# Altium schematic sheet TAS5711.SchDoc
size A3; PageSetup: Record=PageOptions|CenterHorizontal=True|CenterVertical=True|PrintScale=0.68|XCorrection=1.00|YCorrection=1.00|PrintKind=1|BorderSize=5000000|LeftOffset=0|BottomOffset=0|Orientation=2|PaperLength=1000|PaperWidth=1000|Scale=100|PaperSource=7|PrintQuality=-4|MediaType=1|DitherType=10|PrintScaleMode=1|PaperKind=A3
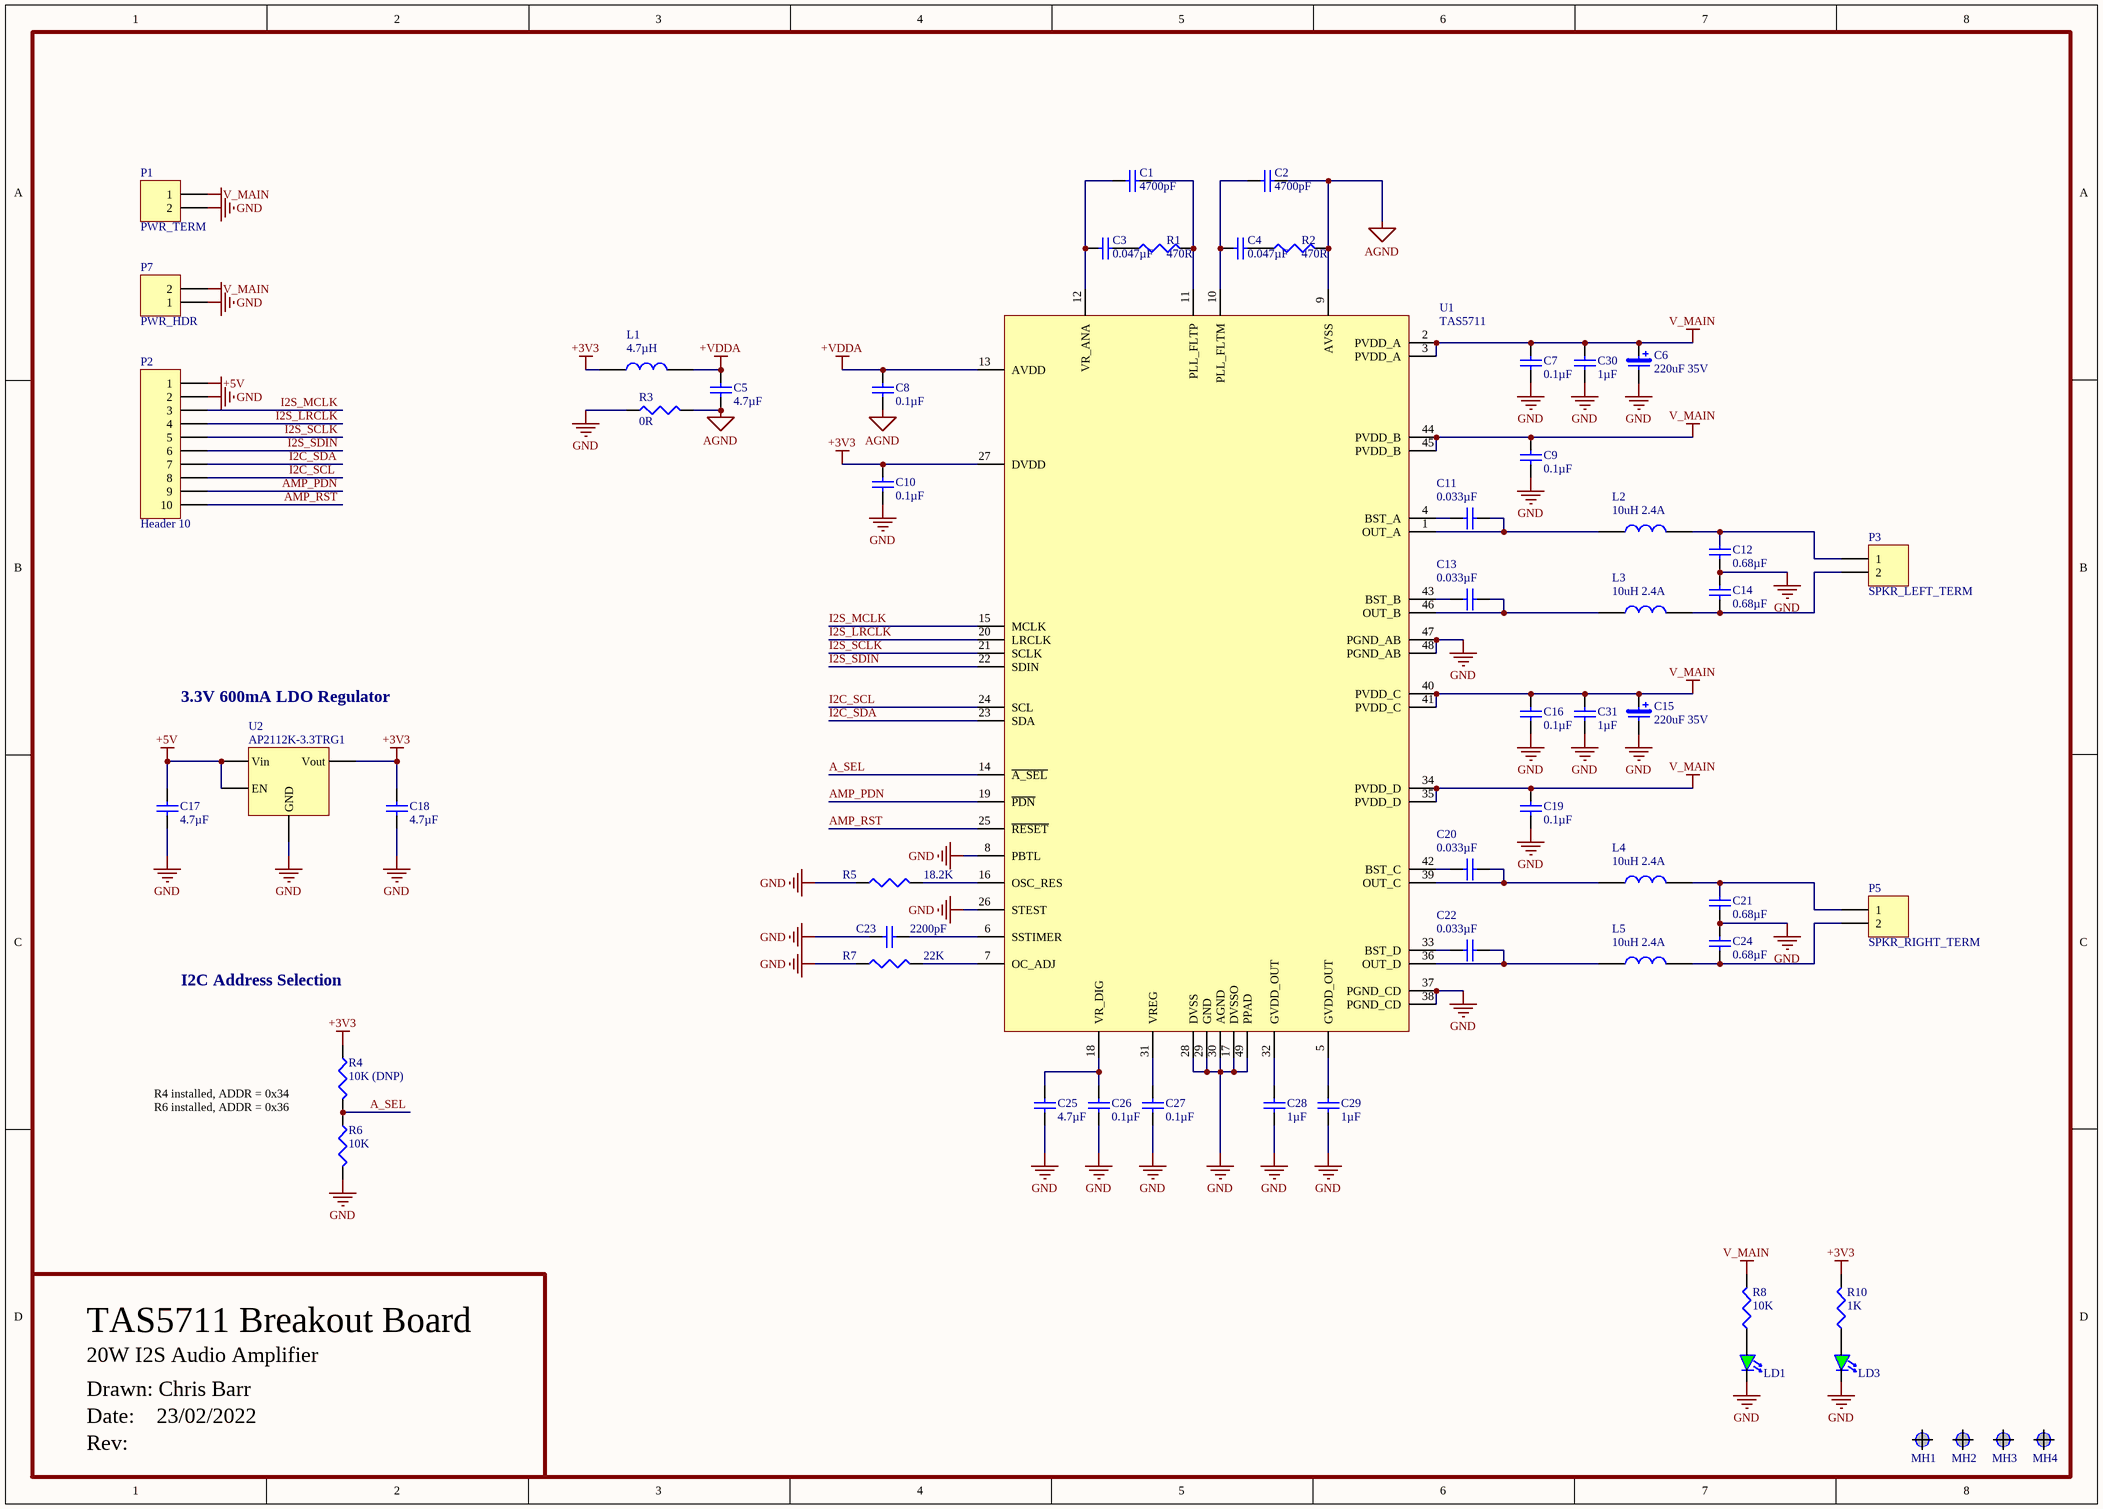
[diagram p0: TAS5711.SchDoc]

## Parts
C1  value 4700pF  [CAPC1608X90N]  (hidden comment: Capacitor)
C2  value 4700pF  [CAPC1608X90N]  (hidden comment: Capacitor)
C3  value 0.047µF  [CAPC1608X90N]  (hidden comment: Capacitor)
C4  value 0.047µF  [CAPC1608X90N]  (hidden comment: Capacitor)
C5  value 4.7µF  [CAPC1608X90N]  (hidden comment: Capacitor)
C6  value 220uF 35V  [CAPAE250P680X1220_VERT]  (hidden comment: CapE-8.0-THT-220uF-35V)
C7  value 0.1µF  [CAPC1608X90N]  (hidden comment: Capacitor)
C8  value 0.1µF  [CAPC1608X90N]  (hidden comment: Capacitor)
C9  value 0.1µF  [CAPC1608X90N]  (hidden comment: Capacitor)
C10  value 0.1µF  [CAPC1608X90N]  (hidden comment: Capacitor)
C11  value 0.033µF  [CAPC1608X90N]  (hidden comment: Capacitor)
C12  value 0.68µF  [CAPC3216X100N]  (hidden comment: Capacitor)
C13  value 0.033µF  [CAPC1608X90N]  (hidden comment: Capacitor)
C14  value 0.68µF  [CAPC3216X100N]  (hidden comment: Capacitor)
C15  value 220uF 35V  [CAPAE250P680X1220_VERT]  (hidden comment: CapE-8.0-THT-220uF-35V)
C16  value 0.1µF  [CAPC1608X90N]  (hidden comment: Capacitor)
C17  value 4.7µF  [CAPC1608X90N]  (hidden comment: Capacitor)
C18  value 4.7µF  [CAPC1608X90N]  (hidden comment: Capacitor)
C19  value 0.1µF  [CAPC1608X90N]  (hidden comment: Capacitor)
C20  value 0.033µF  [CAPC1608X90N]  (hidden comment: Capacitor)
C21  value 0.68µF  [CAPC3216X100N]  (hidden comment: Capacitor)
C22  value 0.033µF  [CAPC1608X90N]  (hidden comment: Capacitor)
C23  value 2200pF  [CAPC1608X90N]  (hidden comment: Capacitor)
C24  value 0.68µF  [CAPC3216X100N]  (hidden comment: Capacitor)
C25  value 4.7µF  [CAPC1608X90N]  (hidden comment: Capacitor)
C26  value 0.1µF  [CAPC1608X90N]  (hidden comment: Capacitor)
C27  value 0.1µF  [CAPC1608X90N]  (hidden comment: Capacitor)
C28  value 1µF  [CAPC1608X90N]  (hidden comment: Capacitor)
C29  value 1µF  [CAPC1608X90N]  (hidden comment: Capacitor)
C30  value 1µF  [CAPC1608X90N]  (hidden comment: Capacitor)
C31  value 1µF  [CAPC1608X90N]  (hidden comment: Capacitor)
L1  value 4.7µH  [Res 2012-0805]
L2  value 10uH 2.4A  [SRN6045TA SMD Inductor]  (hidden comment: Inductor SMD 10uH 2.4A)
L3  value 10uH 2.4A  [SRN6045TA SMD Inductor]  (hidden comment: Inductor SMD 10uH 2.4A)
L4  value 10uH 2.4A  [SRN6045TA SMD Inductor]  (hidden comment: Inductor SMD 10uH 2.4A)
L5  value 10uH 2.4A  [SRN6045TA SMD Inductor]  (hidden comment: Inductor SMD 10uH 2.4A)
LD1  LEDG  0603  [LED 1608-0603]  (value not drawn)
LD3  LEDG  0603  [LED 1608-0603]  (value not drawn)
MH1  Screw Hole  [M3-Hole-2]  (value not drawn)  (no BOM)
MH2  Screw Hole  [M3-Hole-2]  (value not drawn)  (no BOM)
MH3  Screw Hole  [M3-Hole-2]  (value not drawn)  (no BOM)
MH4  Screw Hole  [M3-Hole-2]  (value not drawn)  (no BOM)
P1  PWR_TERM  [TERM2 3.5mm]
P2  Header 10  [HDR1X10]
P3  SPKR_LEFT_TERM  [TERM2 3.5mm]
P5  SPKR_RIGHT_TERM  [TERM2 3.5mm]
P7  PWR_HDR  [HDR1X2-HEADER]
R1  value 470R  [RES 1608-0603]  (hidden comment: Resistor)
R2  value 470R  [RES 1608-0603]  (hidden comment: Resistor)
R3  value 0R  [RES 1608-0603]  (hidden comment: Res-0603-0R)
R4  value 10K (DNP)  [RES 1608-0603]  (hidden comment: Resistor)  (no BOM)
R5  value 18.2K  [RES 1608-0603]  (hidden comment: Resistor)
R6  value 10K  [RES 1608-0603]  (hidden comment: Resistor)
R7  value 22K  [RES 1608-0603]  (hidden comment: Resistor)
R8  value 10K  [RES 1608-0603]  (hidden comment: Resistor)
R10  value 1K  [RES 1608-0603]  (hidden comment: Resistor)
U1  TAS5711  [TSQFP50P900X900X105_HS-49M]
U2  AP2112K-3.3TRG1  [SOT23-5]

## Nets
+3V3: C10.2 C18.2 L1.1 R4.1 R10.2 U1.27(DVDD) U2.5(Vout)
+5V: C17.2 P2.1 U2.1(Vin) U2.3(EN)
+VDDA: C5.2 C8.2 L1.2 U1.13(AVDD)
AGND: C2.2 C5.1 C8.1 R2.2 R3.2 U1.9(AVSS)
GND: C6.2 C7.1 C9.1 C10.1 C12.1 C14.2 C15.2 C16.1 C17.1 C18.1 C19.1 C21.1 C23.1 C24.2 C25.1 C26.1 C27.1 C28.1 C29.1 C30.1 C31.1 LD1.2(K) LD3.2(K) P1.2 P2.2 P7.1 R3.1 R5.1 R6.2 R7.1 U1.8(PBTL) U1.17(DVSSO) U1.26(STEST) U1.28(DVSS) U1.29(GND) U1.30(AGND) U1.37(PGND_CD) U1.38(PGND_CD) U1.47(PGND_AB) U1.48(PGND_AB) U1.49(PPAD) U2.2(GND)
V_MAIN: C6.1 C7.2 C9.2 C15.1 C16.2 C19.2 C30.2 C31.2 P1.1 P7.2 R8.2 U1.2(PVDD_A) U1.3(PVDD_A) U1.34(PVDD_D) U1.35(PVDD_D) U1.40(PVDD_C) U1.41(PVDD_C) U1.44(PVDD_B) U1.45(PVDD_B)
A_SEL: R4.2 R6.1 U1.14(~{A_SEL})
AMP_PDN: P2.9 U1.19(~{PDN})
AMP_RST: P2.10 U1.25(~{RESET})
I2C_SCL: P2.8 U1.24(SCL)
I2C_SDA: P2.7 U1.23(SDA)
I2S_LRCLK: P2.4 U1.20(LRCLK)
I2S_MCLK: P2.3 U1.15(MCLK)
I2S_SCLK: P2.5 U1.21(SCLK)
I2S_SDIN: P2.6 U1.22(SDIN)
NetC1_1: C1.1 C3.1 U1.12(VR_ANA)
NetC1_2: C1.2 R1.2 U1.11(PLL_FLTP)
NetC2_1: C2.1 C4.1 U1.10(PLL_FLTM)
NetC3_2: C3.2 R1.1
NetC4_2: C4.2 R2.1
NetC11_1: C11.1 U1.4(BST_A)
NetC11_2: C11.2 L2.1 U1.1(OUT_A)
NetC12_2: C12.2 L2.2 P3.1
NetC13_1: C13.1 U1.43(BST_B)
NetC13_2: C13.2 L3.1 U1.46(OUT_B)
NetC14_1: C14.1 L3.2 P3.2
NetC20_1: C20.1 U1.42(BST_C)
NetC20_2: C20.2 L4.1 U1.39(OUT_C)
NetC21_2: C21.2 L4.2 P5.1
NetC22_1: C22.1 U1.33(BST_D)
NetC22_2: C22.2 L5.1 U1.36(OUT_D)
NetC23_2: C23.2 U1.6(SSTIMER)
NetC24_1: C24.1 L5.2 P5.2
NetC25_2: C25.2 C26.2 U1.18(VR_DIG)
NetC27_2: C27.2 U1.31(VREG)
NetC28_2: C28.2 U1.32(GVDD_OUT)
NetC29_2: C29.2 U1.5(GVDD_OUT)
NetLD1_1: LD1.1(A) R8.1
NetLD3_1: LD3.1(A) R10.1
NetR5_2: R5.2 U1.16(OSC_RES)
NetR7_2: R7.2 U1.7(OC_ADJ)

Not connected (* = marked no-connect by the designer): MH1 M3(0); MH2 M3(0); MH3 M3(0); MH4 M3(0)

## Notes on the sheet
- 3.3V 600mA LDO Regulator
- I2C Address Selection
- R4 installed, ADDR = 0x34
  R6 installed, ADDR = 0x36
- TAS5711 Breakout Board
- Drawn: Chris Barr
- 20W I2S Audio Amplifier
- Date:    23/02/2022
- Rev:
- Title
- Size:
- Date:
- File:
- A1
- Number:
- Time:
- Revision:
- Sheet
- of

## Library data of the parts
C1 C2 = UMJ107BB7472KAHT: CAP CER 4700PF 50V X7R 0603; Manufacturer 1: Taiyo Yuden; Note: Approved sub OK; Tolerance: ±10%; Type: X5R; Revision: July-2002: Re-released for DXP Platform.; Voltage: 50V; Supplier 1: Digi-Key; Supplier Part Number 1: 587-4470-1-ND; Package: 0402; Manufacturer Part Number 1: UMJ107BB7472KAHT; Temperature Coefficient: X7R; Operating Temperature: -55°C ~ 125°C; Package / Case: 0603 (1608 Metric); Size / Dimension: 0.063" L x 0.031" W (1.60mm x 0.80mm); Thickness (Max): 0.039" (1.00mm)
C3 C4 = TMK107BJ473KAHT: CAP CER 0.047UF 25V X5R 0603; Manufacturer 1: Taiyo Yuden; Note: Approved sub OK; Tolerance: ±10%; Revision: July-2002: Re-released for DXP Platform.; Voltage: 25V; Supplier 1: Digi-Key; Supplier Part Number 1: 587-3475-1-ND; Package: 0402; Type: X5R; Manufacturer Part Number 1: TMK107BJ473KAHT; Temperature Coefficient: X5R; Operating Temperature: -55°C ~ 85°C; Package / Case: 0603 (1608 Metric); Size / Dimension: 0.063" L x 0.031" W (1.60mm x 0.80mm); Thickness (Max): 0.035" (0.90mm)
C5 C17 C18 C25 = C1608X5R1C475K080AC: CAP CER 4.7UF 16V X5R 0603; Manufacturer 1: TDK Corporation; Note: Approved sub OK; Tolerance: ±10%; Revision: July-2002: Re-released for DXP Platform.; Voltage: 16V; Supplier 1: Digi-Key; Supplier Part Number 1: 445-7478-1-ND; Package: 0402; Type: X5R; Manufacturer Part Number 1: C1608X5R1C475K080AC; Temperature Coefficient: X5R; Operating Temperature: -55°C ~ 85°C; Package / Case: 0603 (1608 Metric); Size / Dimension: 0.063" L x 0.031" W (1.60mm x 0.80mm); Thickness (Max): 0.035" (0.90mm)
C6 C15 = CapE-8.0-THT-220uF-35V: CAP ALUM 220UF 20% 35V RADIAL; Note: Approved sub OK; Published: 8-Jun-2000; Revision: July-2002: Re-released for DXP Platform.; Publisher: Altium Limited; Supplier 1: Digi-Key; Supplier Part Number 1: 732-8946-1-ND
C7-C10 C16 C19 C26 C27 = UMJ107BB7104KAHT: CAP CER 0.1UF 50V X7R 0603; Manufacturer 1: Taiyo Yuden; Note: Approved sub OK; Tolerance: ±10%; Type: X5R; Revision: July-2002: Re-released for DXP Platform.; Voltage: 50V; Supplier 1: Digi-Key; Supplier Part Number 1: 587-4474-1-ND; Package: 0402; Manufacturer Part Number 1: UMJ107BB7104KAHT; Temperature Coefficient: X7R; Operating Temperature: -55°C ~ 125°C; Package / Case: 0603 (1608 Metric); Size / Dimension: 0.063" L x 0.031" W (1.60mm x 0.80mm); Thickness (Max): 0.039" (1.00mm)
C11 C13 C20 C22 = UMJ107BB7104KAHT: CAP CER 0.033UF 50V X7R 0603; Manufacturer 1: Taiyo Yuden; Note: Approved sub OK; Tolerance: ±10%; Revision: July-2002: Re-released for DXP Platform.; Voltage: 50V; Supplier 1: Digi-Key; Supplier Part Number 1: 399-14292-1-ND; Package: 0402; Type: X7R; Manufacturer Part Number 1: UMJ107BB7104KAHT; Temperature Coefficient: X7R; Operating Temperature: -55°C ~ 125°C; Package / Case: 0603 (1608 Metric); Size / Dimension: 0.063" L x 0.031" W (1.60mm x 0.80mm); Thickness (Max): 0.039" (1.00mm)
C12 C14 C21 C24 = C3216X7R2A684K160AA: CAP CER 0.68UF 100V X7R 1206; Manufacturer 1: TDK Corporation; Note: Approved sub OK; Tolerance: ±10%; Type: X5R; Revision: July-2002: Re-released for DXP Platform.; Voltage: 100V; Supplier 1: Digi-Key; Supplier Part Number 1: 445-14810-1-ND; Package: 0402; Manufacturer Part Number 1: C3216X7R2A684K160AA; Temperature Coefficient: X7R; Operating Temperature: -55°C ~ 125°C; Package / Case: 1206 (3216 Metric); Size / Dimension: 0.126" L x 0.063" W (3.20mm x 1.60mm); Thickness (Max): 0.071" (1.80mm)
C23 = C1608X5R2A222M080AA: CAP CER 2200PF 100V X5R 0603; Manufacturer 1: TDK Corporation; Note: Approved sub OK; Tolerance: ±20%; Revision: July-2002: Re-released for DXP Platform.; Voltage: 100V; Supplier 1: Digi-Key; Supplier Part Number 1: 445-14182-1-ND; Package: 0402; Type: X5R; Manufacturer Part Number 1: C1608X5R2A222M080AA; Temperature Coefficient: X5R; Operating Temperature: -55°C ~ 85°C; Package / Case: 0603 (1608 Metric); Size / Dimension: 0.063" L x 0.031" W (1.60mm x 0.80mm); Thickness (Max): 0.035" (0.90mm)
C28-C31 = GMK107BJ105KAHT: CAP CER 1UF 35V X5R 0603; Manufacturer 1: Taiyo Yuden; Note: Approved sub OK; Tolerance: ±10%; Revision: July-2002: Re-released for DXP Platform.; Voltage: 35V; Supplier 1: Digi-Key; Supplier Part Number 1: 587-3358-1-ND; Package: 0402; Type: X5R; Manufacturer Part Number 1: GMK107BJ105KAHT; Temperature Coefficient: X5R; Operating Temperature: -55°C ~ 85°C; Package / Case: 0603 (1608 Metric); Size / Dimension: 0.063" L x 0.031" W (1.60mm x 0.80mm); Thickness (Max): 0.035" (0.90mm)
L1 = Ferrite Bead SMD 0805: FIXED IND 4.7UH 500MA 300MOHM SM; Note: Approved sub OK; Published: 24-Mar-1999; Revision: July-2002: Re-released for DXP Platform.; Publisher: Altium Limited; Supplier 1: Digi-Key; Supplier Part Number 1: 445-6401-1-ND
L2-L5 = Inductor SMD 33uH 2.5A: FIXED IND 10UH 2.4A 59.8MOHM SMD; Published: 24-Mar-1999; Revision: July-2002: Re-released for DXP Platform.; Publisher: Altium Limited; Supplier 1: Digi-Key; Supplier Part Number 1: 587-2946-1-ND
LD1 LD3 = LEDG  0603: LED GREEN CLEAR CHIP SMD 0603; Note: Approved sub OK; Supplier 1: Digi-Key; Supplier Part Number 1: 160-1435-2-ND
P1 P3 P5 = ScrewTerminal-3.5mm-2Way: Screw Terminal 3.5mm 2-Way; Note: Approved sub OK; Supplier 1: Digi-Key; Supplier Part Number 1: 277-5719-ND
P2 = Header 10: Header, 10-Pin; Manufacturer 1: Generic Header; Note: Approved sub OK; LatestRevisionDate: 17-Jul-2002; LatestRevisionNote: Re-released for DXP Platform.; Publisher: Altium Limited
P7 = Header 1X2: Header, 2-Pin; Manufacturer 1: Generic Header; Note: Approved sub OK
R1 R2 = RC0603FR-07470RL: RES SMD 470 OHM 1% 1/10W 0603; Manufacturer 1: Yageo; Note: Approved sub OK; Power (Watts): 0.1W, 1/10W; Temperature Coefficient: ±100ppm/°C; Published: 8-Jun-2000; Revision: July-2002: Re-released for DXP Platform.; Publisher: Altium Limited; Supplier 1: Digi-Key; Supplier Part Number 1: 311-470HRCT-ND; Manufacturer Part Number 1: RC0603FR-07470RL; Tolerance: ±1%; Composition: Thick Film; Features: Moisture Resistant; Operating Temperature: -55°C ~ 155°C; Package / Case: 0603 (1608 Metric); Size / Dimension: 0.063" L x 0.031" W (1.60mm x 0.80mm); Height - Seated (Max): 0.022" (0.55mm)
R3 = Res-0603-0R: RES 0 OHM JUMPER 1/10W 0603; Note: Approved sub OK; Published: 8-Jun-2000; Revision: July-2002: Re-released for DXP Platform.; Publisher: Altium Limited; Supplier 1: Digi-Key; Supplier Part Number 1: 311-0.0GRCT-ND
R4 R6 R8 = RC0603FR-0710KL: RES SMD 10K OHM 1% 1/10W 0603; Manufacturer 1: Yageo; Note: Approved sub OK; Power (Watts): 0.1W, 1/10W; Temperature Coefficient: ±100ppm/°C; Published: 8-Jun-2000; Revision: July-2002: Re-released for DXP Platform.; Publisher: Altium Limited; Supplier 1: Digi-Key; Supplier Part Number 1: 311-10.0KHRCT-ND; Manufacturer Part Number 1: RC0603FR-0710KL; Tolerance: ±1%; Composition: Thick Film; Features: Moisture Resistant; Operating Temperature: -55°C ~ 155°C; Package / Case: 0603 (1608 Metric); Size / Dimension: 0.063" L x 0.031" W (1.60mm x 0.80mm); Height - Seated (Max): 0.022" (0.55mm)
R5 = RC0603FR-0718K2L: RES SMD 18.2K OHM 1% 1/10W 0603; Manufacturer 1: Yageo; Note: Approved sub OK; Power (Watts): 0.1W, 1/10W; Temperature Coefficient: ±100ppm/°C; Published: 8-Jun-2000; Revision: July-2002: Re-released for DXP Platform.; Publisher: Altium Limited; Supplier 1: Digi-Key; Supplier Part Number 1: 311-18.2KHRCT-ND; Manufacturer Part Number 1: RC0603FR-0718K2L; Tolerance: ±1%; Composition: Thick Film; Features: Moisture Resistant; Operating Temperature: -55°C ~ 155°C; Package / Case: 0603 (1608 Metric); Size / Dimension: 0.063" L x 0.031" W (1.60mm x 0.80mm); Height - Seated (Max): 0.022" (0.55mm)
R7 = RC0603FR-0722KL: RES SMD 22K OHM 1% 1/10W 0603; Manufacturer 1: Yageo; Note: Approved sub OK; Power (Watts): 0.1W, 1/10W; Temperature Coefficient: ±100ppm/°C; Published: 8-Jun-2000; Revision: July-2002: Re-released for DXP Platform.; Publisher: Altium Limited; Supplier 1: Digi-Key; Supplier Part Number 1: 311-22.0KHRCT-ND; Manufacturer Part Number 1: RC0603FR-0722KL; Tolerance: ±1%; Composition: Thick Film; Features: Moisture Resistant; Operating Temperature: -55°C ~ 155°C; Package / Case: 0603 (1608 Metric); Size / Dimension: 0.063" L x 0.031" W (1.60mm x 0.80mm); Height - Seated (Max): 0.022" (0.55mm)
R10 = RC0603FR-071KL: RES SMD 1K OHM 1% 1/10W 0603; Manufacturer 1: Yageo; Note: Approved sub OK; Power (Watts): 0.1W, 1/10W; Temperature Coefficient: ±100ppm/°C; Published: 8-Jun-2000; Revision: July-2002: Re-released for DXP Platform.; Publisher: Altium Limited; Supplier 1: Digi-Key; Supplier Part Number 1: 311-1.00KHRCT-ND; Manufacturer Part Number 1: RC0603FR-071KL; Tolerance: ±1%; Composition: Thick Film; Features: Moisture Resistant; Operating Temperature: -55°C ~ 155°C; Package / Case: 0603 (1608 Metric); Size / Dimension: 0.063" L x 0.031" W (1.60mm x 0.80mm); Height - Seated (Max): 0.022" (0.55mm)
U1 = IC - DAC, I2S Amplifier - TAS5711: IC AMP D DUAL/QUAD 21W 48HTQFP; Supplier 1: Digi-Key; Supplier Part Number 1: 296-25564-1-ND
U2 = Regulator - AP2112K 3.3V Linear Regulator: IC REG LINEAR 3.3V 600MA SOT25; Manufacturer 1: Diodes Incorporated; Supplier 1: Digi-Key; Supplier Part Number 1: AP2112K-3.3TRG1DICT-ND; Manufacturer Part Number 1: AP2112K-3.3TRG1